# EAGLE board SaintCon2015Badge (EAGLE 7.3.0)
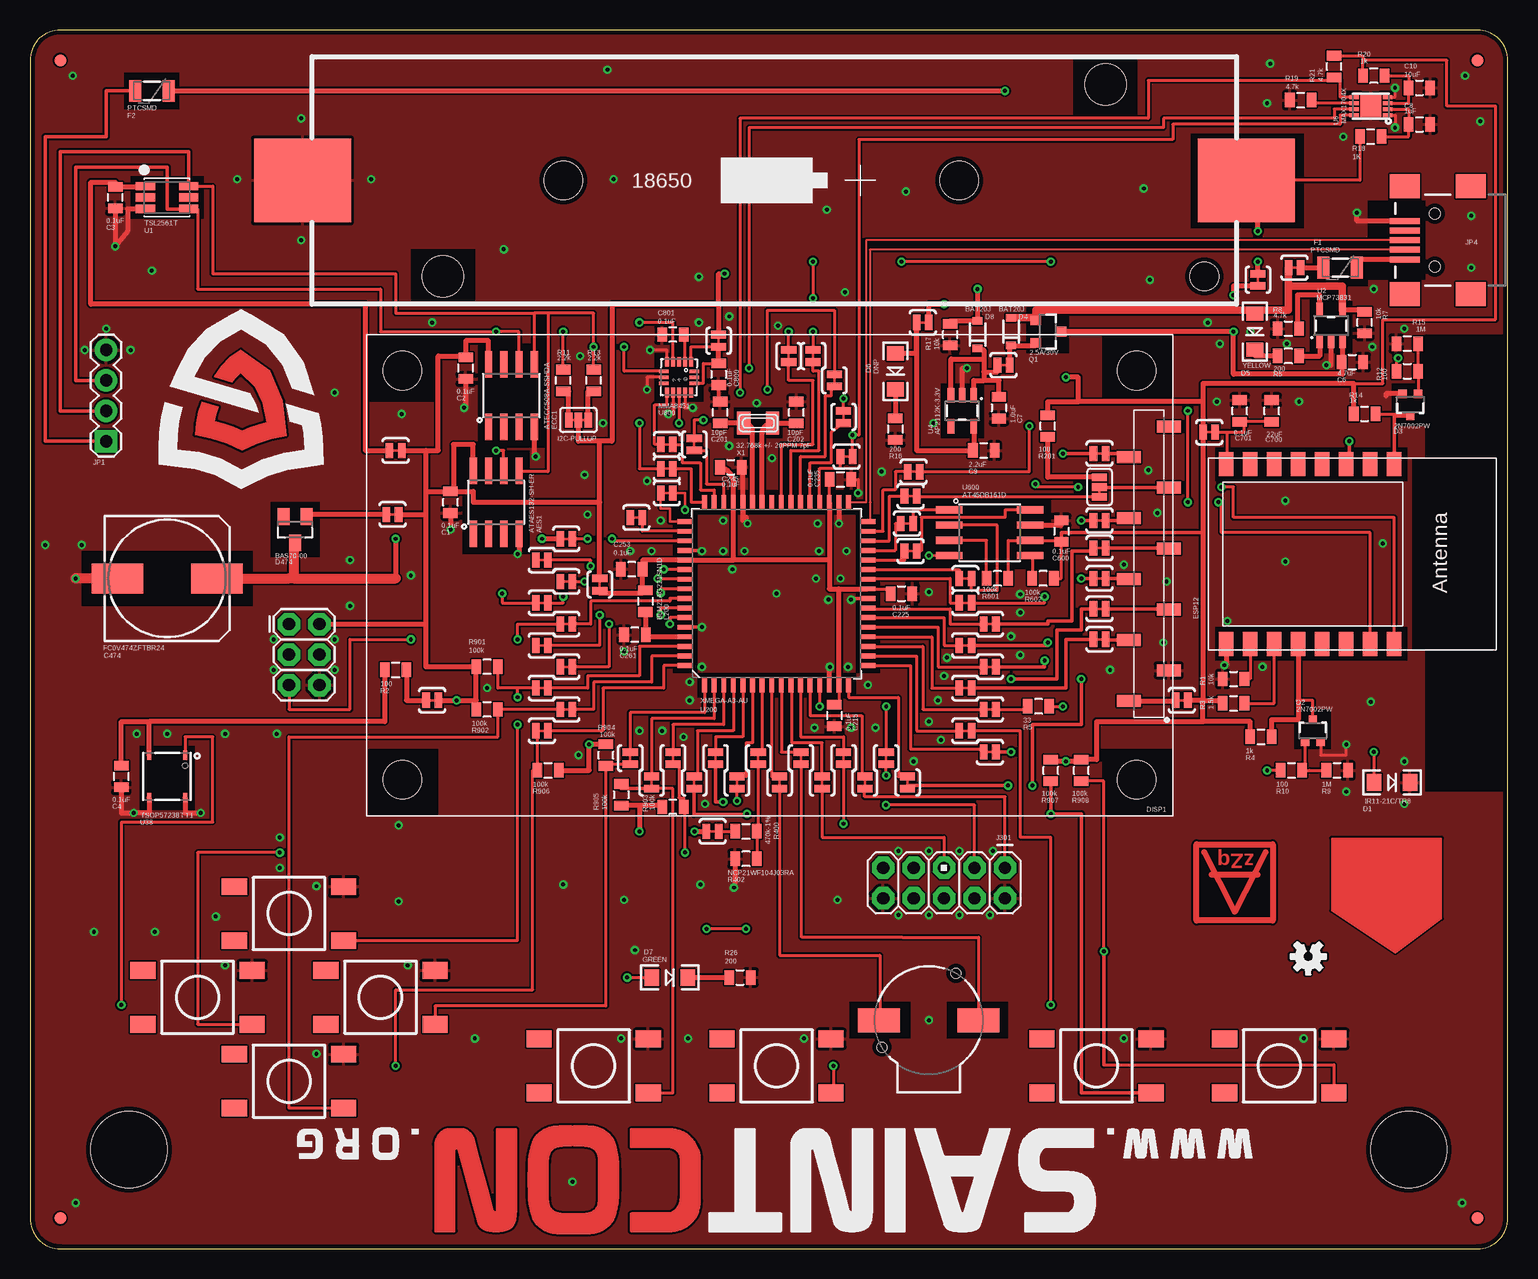
[diagram p3: board, top side]
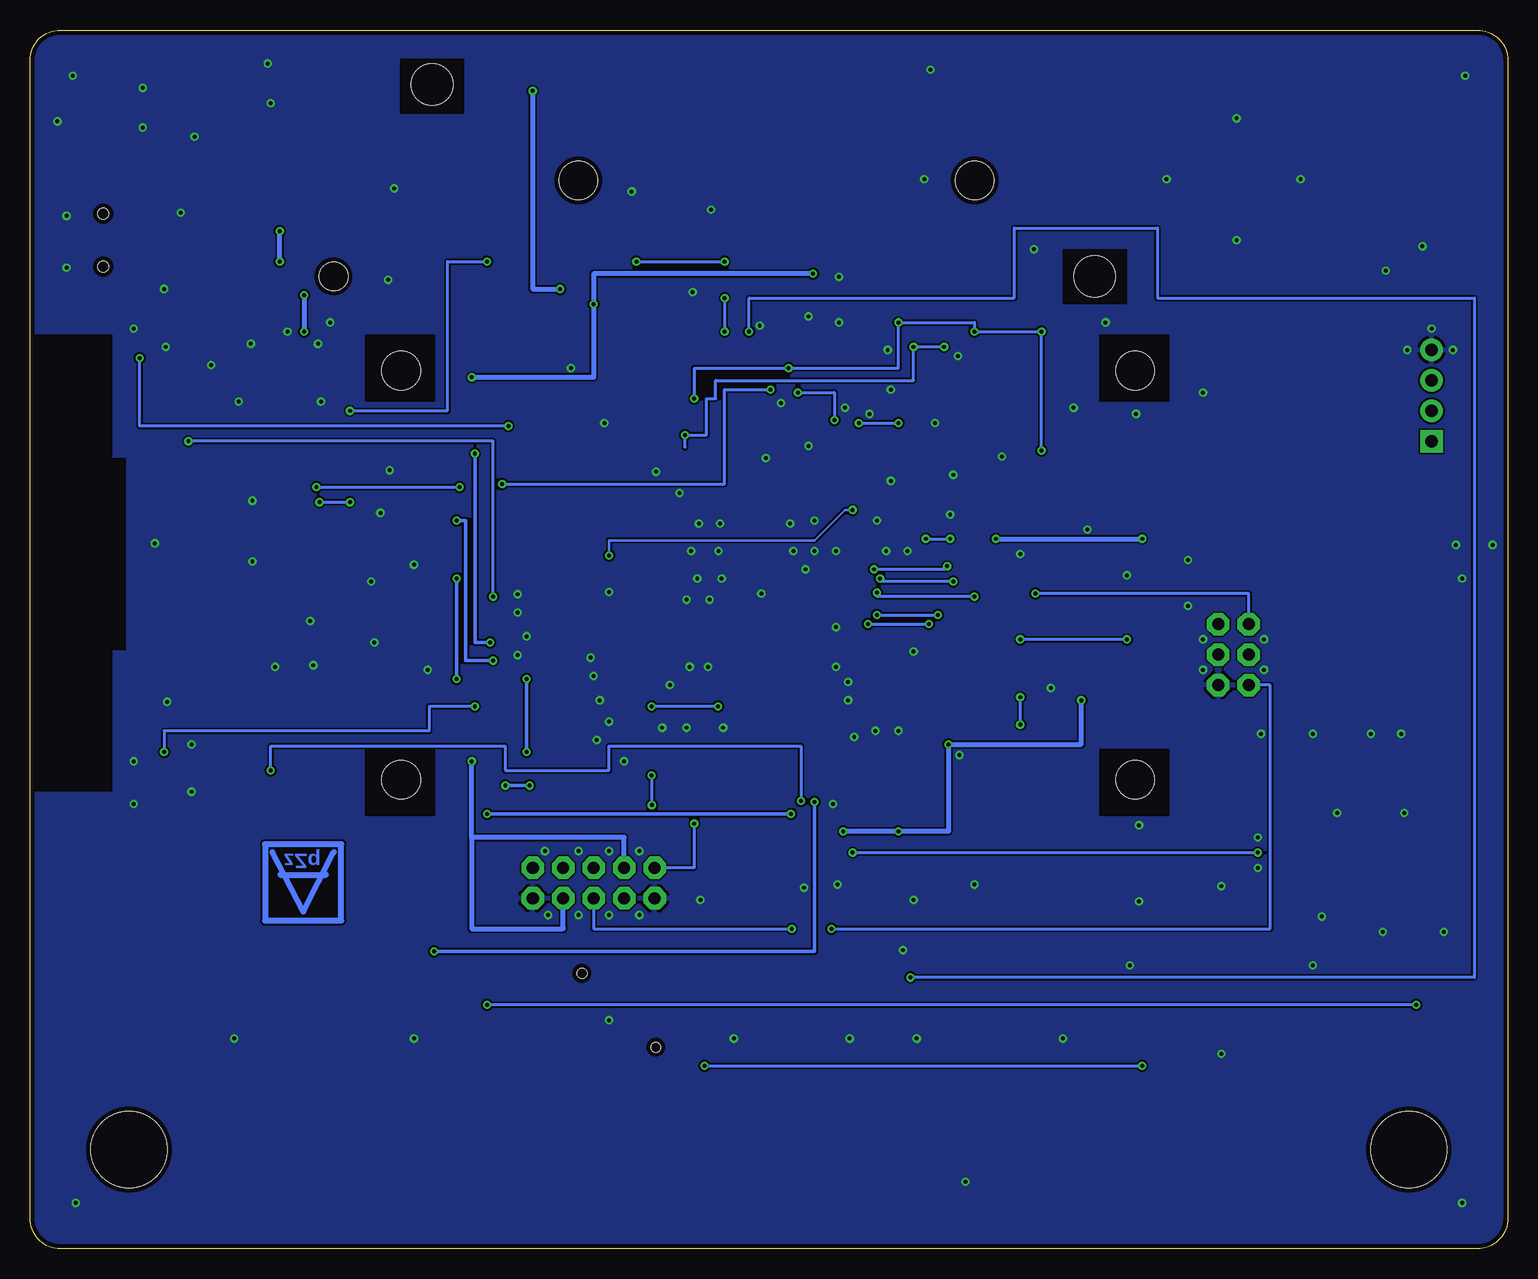
[diagram p4: board, bottom side, seen from below]

Size 123.19 x 101.6 mm. Coordinates in mm from the lower left corner, seen from the top.
Outline: 0,99.06 0,2.54 arc90 2.54,0 120.65,0 arc90 123.19,2.54 123.19,99.06 arc90 120.65,101.6 2.54,101.6 arc90 0,99.06
Copper layers (1*16): Top 0.0356mm / dielectric 1.5011mm / Bottom 0.0356mm
Design rules "LaenPCBOrder": minimum track width 6mil, minimum drill 13mil, track to track 6mil, track to pad 6mil, pad to pad 6mil, via to via 6mil, smd to smd 6mil, copper to edge 15mil, drill to drill 6mil, minimum pad ring 7mil, minimum via ring 7mil, stop-mask expansion 3mil, vias tented up to drill 14mil, thermal gap 10mil
Holes 6.35 mm at 8.26,8.26 114.94,8.26
tRestrict: area 116.3,38.1 to 123.2,76.2; area 106.7,74.7 to 110.2,79; area 75.9,67.6 to 79.5,72.1; area 9.1,36.6 to 13.7,41.9; area 8.4,85.9 to 14.5,89.4; area 53.6,48 to 55.6,61.2; area 68.8,48 to 70.9,61.2; area 55.6,61.2 to 68.8,63.2; area 55.6,46 to 68.8,48; area 98.8,49 to 114.8,51.8; area 98.8,64 to 114.8,66.8; area 52.1,70.6 to 56.1,74.7; 21 more areas
bRestrict: area 116.3,38.1 to 123.2,76.2; area 28.2,36.1 to 34,41.7; area 89.4,70.6 to 95.2,76.2; area 89.4,36.1 to 95.2,41.7; area 28.2,70.6 to 34,76.2

## Footprints (pad centres in the part's own frame; a part is rotated, then mirrored left to right if it is on the bottom)
SOIC8 = smd 0.61 x 2.21: 1 -1.905,-2.616; 2 -0.635,-2.616; 3 0.635,-2.616; 4 1.905,-2.616; 5 1.905,2.616; 6 0.635,2.616; 7 -0.635,2.616; 8 -1.905,2.616
1042P = smd 8.077 x 6.985: BATT_NEG 3.67,10.325; BATT_POS 82.334,10.325 | hole 3.454: 15.38,2.324; 70.625,18.326 | hole 2.388: 78.842,2.324 | hole 3.2: 25.4,10.325; 58.42,10.325
0805 = smd 0.8 x 1.2: 1 -0.9,0; 2 0.9,0
153CLV-1014 = smd 4.3 x 2.5: + 4.15,0; - -4.15,0
LED-1206 = smd 1.2 x 1.4: A -1.5,0; C 1.5,0
SOT323 = smd 0.7 x 0.7: 1 -0.65,-0.925; 2 0.65,-0.925; 3 0,0.925
SOD-323 = smd 0.63 x 0.83: A 1.15,0; C -1.15,0
SOT23 = smd 1 x 1.4: 1 -0.95,-1.1; 2 0.95,-1.1; 3 0,1.1
TFT22 = smd 2 x 1: CS 3.63,25.45; D/C 3.63,20.37; GND 0.33,27.99; LED 0.33,12.75; MISO 3.63,10.21; MOSI 0.33,17.83; NC 0.33,7.67; RESET 0.33,22.91; SCK 3.63,15.29; VCC 3.63,30.53 | hole 3.2: 3,3; 3,37.1; 64.2,37.1; 64.2,3
ESP-12 = smd 2 x 1.2: 1 -7.5,4.5; 2 -7.5,2.5; 3 -7.5,0.5; 4 -7.5,-1.5; 5 -7.5,-3.5; 6 -7.5,-5.5; 7 -7.5,-7.5; 8 -7.5,-9.5; 9 7.5,-9.5; 10 7.5,-7.5; 11 7.5,-5.5; 12 7.5,-3.5; 13 7.5,-1.5; 14 7.5,0.5; 15 7.5,2.5; 16 7.5,4.5
PTC-1206 = smd 1 x 1.8: 1 -1.4,0; 2 1.4,0
FIDUCIAL-1X2 = smd 1 x 1: 1 0,0
PAD-JUMPER-3-3OF3_NC_BY_TRACE_YES_SILK_FULL_BOX = smd 0.635 x 1.27: 1 -0.813,0; 2 0,0; 3 0.813,0
AVR_ICSP = drill 1.016 pad 1.88 octagon: 1 -1.27,5.08; 2 1.27,5.08; 3 -1.27,2.54; 4 1.27,2.54; 5 -1.27,0; 6 1.27,0; 7 -1.27,-2.54; 8 1.27,-2.54; 9 -1.27,-5.08; 10 1.27,-5.08
1X04 = drill 1.016 pad 1.88 square: 1 0,0 | drill 1.016 pad 1.88: 2 2.54,0; 3 5.08,0; 4 7.62,0
USB-MINIB = smd 2.5 x 0.5: D+ 2.5,0; D- 2.5,0.8; GND 2.5,-1.6; ID 2.5,-0.8; VBUS 2.5,1.6 | smd 2.5 x 2: MTN1 -3,4.5; MTN2 2.5,4.5; MTN3 -3,-4.5; MTN4 2.5,-4.5 | hole 0.9: 0,2.2; 0,-2.2
2X3 = drill 1.016 pad 1.88 octagon: 1 0,0; 2 0,2.54; 3 2.54,0; 4 2.54,2.54; 5 5.08,0; 6 5.08,2.54
SOT23-3 = smd 0.8 x 0.9: 1 -0.95,-1; 2 0.95,-1; 3 0,1.1
TACTILE_SWITCH_ZZQ = smd 2.1 x 1.4: A1 -4.55,-2.25; A2 4.55,-2.25; B1 -4.55,2.25; B2 4.55,2.25
BUZZER-CCV-KIT = smd 3.5 x 2: + 4.15,0; - -4.15,0 | hole 0.8: -3.9,-2.25; 2.25,3.9
PAD-JUMPER-2-NC_BY_TRACE_YES_SILK = smd 0.635 x 1.27: 1 -0.508,0; 2 0.508,0
PAD-JUMPER-3-2OF3_NC_BY_TRACE_YES_SILK_FULL_BOX = smd 0.635 x 1.27: 1 -0.813,0; 2 0,0; 3 0.813,0
TMB-6 = smd 1.6 x 0.7: 1 -1.8,0.95; 2 -1.8,0; 3 -1.8,-0.95; 4 1.8,-0.95; 5 1.8,0; 6 1.8,0.95
SOT23-5 = smd 0.55 x 1.2: 1 -0.95,-1.3; 2 0,-1.3; 3 0.95,-1.3; 4 0.95,1.3; 5 -0.95,1.3
TDFN-8 = smd 0.8 x 0.3: 1 -1.4,0.75; 2 -1.4,0.25; 3 -1.4,-0.25; 4 -1.4,-0.75; 5 1.4,-0.75; 6 1.4,-0.25; 7 1.4,0.25; 8 1.4,0.75 | smd 1.73 x 1.88: EP 0,0
TSOP572 = smd 0.35 x 0.8: 1 -1.5,-1.775; 5 1.5,-1.775; 6 1.5,1.775; 8 -1.5,1.775
TQFP64_14X14MM = smd 0.4 x 1.27: 1 -6,-7.6; 2 -5.2,-7.6; 3 -4.4,-7.6; 4 -3.6,-7.6; 5 -2.8,-7.6; 6 -2,-7.6; 7 -1.2,-7.6; 8 -0.4,-7.6; 9 0.4,-7.6; 10 1.2,-7.6; 11 2,-7.6; 12 2.8,-7.6; 13 3.6,-7.6; 14 4.4,-7.6; 15 5.2,-7.6; 16 6,-7.6; 33 6,7.6; 34 5.2,7.6; 35 4.4,7.6; 36 3.6,7.6; 37 2.8,7.6; 38 2,7.6; 39 1.2,7.6; 40 0.4,7.6; 41 -0.4,7.6; 42 -1.2,7.6; 43 -2,7.6; 44 -2.8,7.6; 45 -3.6,7.6; 46 -4.4,7.6; 47 -5.2,7.6; 48 -6,7.6 | smd 1.27 x 0.4: 17 7.6,-6; 18 7.6,-5.2; 19 7.6,-4.4; 20 7.6,-3.6; 21 7.6,-2.8; 22 7.6,-2; 23 7.6,-1.2; 24 7.6,-0.4; 25 7.6,0.4; 26 7.6,1.2; 27 7.6,2; 28 7.6,2.8; 29 7.6,3.6; 30 7.6,4.4; 31 7.6,5.2; 32 7.6,6; 49 -7.6,6; 50 -7.6,5.2; 51 -7.6,4.4; 52 -7.6,3.6; 53 -7.6,2.8; 54 -7.6,2; 55 -7.6,1.2; 56 -7.6,0.4; 57 -7.6,-0.4; 58 -7.6,-1.2; 59 -7.6,-2; 60 -7.6,-2.8; 61 -7.6,-3.6; 62 -7.6,-4.4; 63 -7.6,-5.2; 64 -7.6,-6
SO08-EIAJ = smd 0.61 x 2.21: 1 -1.905,-3.378; 2 -0.635,-3.378; 3 0.635,-3.378; 4 1.905,-3.378; 5 1.905,3.353; 6 0.635,3.353; 7 -0.635,3.353; 8 -1.905,3.353
QFN-16_0.5MM = smd 0.8 x 0.3: 1 -1.275,1; 2 -1.275,0.5; 3 -1.275,0; 4 -1.275,-0.5; 5 -1.275,-1; 9 1.275,-1; 10 1.275,-0.5; 11 1.275,0; 12 1.275,0.5; 13 1.275,1 | smd 0.3 x 0.8: 6 -0.5,-1.275; 7 0,-1.275; 8 0.5,-1.275; 14 0.5,1.275; 15 0,1.275; 16 -0.5,1.275
XTAL3215 = smd 1.1 x 1.9: P$1 1.2,0; P$2 -1.2,0

## Placement (x,y rotation side)
AES1  ATAES132-SH-ER  [SOIC8]  38.86,62.23 0 top
BATT2  1042P  [1042P]  19.05,78.74 0 top
C1  0.1uF  [0805]  35.05,62.23 90 top
C2  0.1uF  [0805]  36.32,73.41 90 top
C3  0.1uF  [0805]  7.11,87.63 90 top
C4  0.1uF  [0805]  7.62,39.37 90 top
C6  4.7uF  [0805]  110.24,73.91 0 top
C7  1.0uF  [0805]  80.77,70.1 270 top
C8  1uF  [0805]  115.82,93.73 0 top
C9  2.2uF  [0805]  79.5,66.55 0 top
C10  10uF  [0805]  115.82,96.77 0 top
C201  10pF  [0805]  57.53,69.72 90 top
C202  10pF  [0805]  63.88,69.72 90 top
C215  0.1uF  [0805]  67.06,44.45 270 top
C225  0.1uF  [0805]  72.64,54.61 0 top
C235  0.1uF  [0805]  67.56,64.14 0 top
C245  0.1uF  [0805]  58.42,65.15 0 top
C253  0.1uF  [0805]  50.16,56.64 180 top
C261  0.1uF  [0805]  50.42,51.18 180 top
C474  FC0V474ZFTBR24  [153CLV-1014]  11.43,55.88 0 top
C600  0.1uF  [0805]  85.98,59.82 270 top
C700  22uF  [0805]  103.5,69.85 90 top
C701  0.1uF  [0805]  100.84,69.85 90 top
C800  0.1uF  [0805]  57.4,72.9 270 top
C801  0.1uF  [0805]  53.59,76.2 180 top
D1  IR11-21C/TR8  [LED-1206]  113.54,38.86 0 top
D2  2N7002PW  [SOT323]  106.93,43.18 0 top
D3  2N7002PW  [SOT323]  115.06,70.36 180 top
D4  BAT20J  [SOD-323]  81.79,76.45 90 top
D5  YELLOW  [LED-1206]  102.11,76.45 270 top
D6  DNP  [LED-1206]  72.14,73.15 270 top
D7  GREEN  [LED-1206]  53.34,22.61 0 top
D8  BAT20J  [SOD-323]  78.99,76.2 90 top
D474  BAS70-00  [SOT23]  22.1,59.94 180 top
DISP1  [TFT22]  95.25,76.2 180 top
ECC1  ATECC508A-SSHDA  [SOIC8]  40.13,71.12 0 top
ESP12  ESP12  [ESP-12]  109.22,57.91 270 top
F1  PTCSMD  [PTC-1206]  109.22,81.79 180 top
F2  PTCSMD  [PTC-1206]  10.16,96.52 180 top
FID1  FIDUCIAL1X2  [FIDUCIAL-1X2]  2.54,2.54 0 top
FID2  FIDUCIAL1X2  [FIDUCIAL-1X2]  120.65,2.54 0 top
FID3  FIDUCIAL1X2  [FIDUCIAL-1X2]  2.54,99.06 0 top
FID4  FIDUCIAL1X2  [FIDUCIAL-1X2]  120.65,99.06 0 top
FRAME1  FRAME-LETTERNO_PACKAGE  [DUMMY]  0,0 0 top
FRAME2  FRAME-LETTERNO_PACKAGE  [DUMMY]  0,0 0 top
FRAME3  FRAME-LETTERNO_PACKAGE  [DUMMY]  0,0 0 top
I2C-PULLUP  [PAD-JUMPER-3-3OF3_NC_BY_TRACE_YES_SILK_FULL_BOX]  45.72,69.09 180 top
J301  [AVR_ICSP]  76.2,30.48 270 top
JP1  [1X04]  6.35,67.31 90 top
JP4  USBSMD  [USB-MINIB]  117.09,84.07 180 top
L200  BLM21AG221SN1D  [0805]  51.31,53.98 270 top
LOGO1  OSHW-LOGOS-COPPER  [OSHW-LOGO-S_COPPER]  106.55,24.36 180 top
LOGO2  OSHW-LOGOS  [OSHW-LOGO-S]  106.55,24.36 180 top
PDI  FEMALE 2x3  [2X3]  21.59,52.07 270 top
Q1  2.5A/30V  [SOT23-3]  84.84,76.45 270 top
R1  10k  [0805]  100.33,47.5 0 top
R2  100  [0805]  30.48,48.26 0 top
R3  1.5k  [0805]  100.33,45.47 0 top
R4  1k  [0805]  102.62,42.67 0 top
R5  33  [0805]  84.07,45.21 180 top
R6  200  [0805]  104.9,74.42 180 top
R7  10k  [0805]  111.25,77.22 90 top
R8  4.7k  [0805]  104.9,76.71 0 top
R9  1M  [0805]  108.97,39.88 0 top
R10  100  [0805]  105.16,39.88 0 top
R11  2.2k  [0805]  44.45,72.39 90 top
R12  100  [0805]  114.81,73.15 0 top
R13  2.2k  [0805]  46.99,72.39 90 top
R14  1k  [0805]  111.25,69.6 0 top
R15  1M  [0805]  114.81,75.44 180 top
R16  200  [0805]  72.14,68.33 270 top
R17  10k  [0805]  76.71,76.2 90 top
R18  1K  [0805]  111.76,92.71 0 top
R19  4.7k  [0805]  105.92,95.76 0 top
R20  1k  [0805]  112.01,97.79 180 top
R21  4.7k  [0805]  108.71,98.55 90 top
R26  200  [0805]  59.18,22.61 0 top
R201  100  [0805]  84.84,68.58 90 top
R400  470k-1%  [0805]  59.69,34.8 0 top
R402  NCP21WF104J03RA  [0805]  59.69,32.51 180 top
R601  100k  [0805]  80.64,55.88 180 top
R602  100k  [0805]  84.45,55.88 180 top
R901  100k  [0805]  38.1,48.51 180 top
R902  100k  [0805]  38.1,44.96 180 top
R903  100k  [0805]  53.59,36.83 180 top
R904  100k  [0805]  48.01,41.15 90 top
R905  100k  [0805]  49.28,37.85 270 top
R906  100k  [0805]  43.18,39.88 0 top
R907  100k  [0805]  85.09,39.88 90 top
R908  100k  [0805]  87.63,39.88 90 top
S1  FSM4JSMA  [TACTILE_SWITCH_ZZQ]  21.59,27.94 0 top
S2  FSM4JSMA  [TACTILE_SWITCH_ZZQ]  21.59,13.97 0 top
S3  FSM4JSMA  [TACTILE_SWITCH_ZZQ]  13.97,20.95 0 top
S4  FSM4JSMA  [TACTILE_SWITCH_ZZQ]  29.21,20.95 0 top
S5  FSM4JSMA  [TACTILE_SWITCH_ZZQ]  46.99,15.24 0 top
S6  FSM4JSMA  [TACTILE_SWITCH_ZZQ]  62.23,15.24 0 top
S7  FSM4JSMA  [TACTILE_SWITCH_ZZQ]  88.9,15.24 0 top
S8  FSM4JSMA  [TACTILE_SWITCH_ZZQ]  104.14,15.24 0 top
SG1  CBT-09427-SMT  [BUZZER-CCV-KIT]  74.93,19.05 0 top
SJ1  JUMPER-PAD-2-NC_BY_TRACE  [PAD-JUMPER-2-NC_BY_TRACE_YES_SILK]  50.04,40.89 270 top
SJ2  JUMPER-PAD-2-NC_BY_TRACE  [PAD-JUMPER-2-NC_BY_TRACE_YES_SILK]  51.82,38.86 270 top
SJ3  JUMPER-PAD-2-NC_BY_TRACE  [PAD-JUMPER-2-NC_BY_TRACE_YES_SILK]  53.59,40.89 270 top
SJ4  JUMPER-PAD-2-NC_BY_TRACE  [PAD-JUMPER-2-NC_BY_TRACE_YES_SILK]  55.37,38.86 270 top
SJ5  JUMPER-PAD-2-NC_BY_TRACE  [PAD-JUMPER-2-NC_BY_TRACE_YES_SILK]  57.15,40.89 270 top
SJ6  JUMPER-PAD-2-NC_BY_TRACE  [PAD-JUMPER-2-NC_BY_TRACE_YES_SILK]  58.93,38.86 270 top
SJ7  JUMPER-PAD-2-NC_BY_TRACE  [PAD-JUMPER-2-NC_BY_TRACE_YES_SILK]  60.71,40.89 270 top
SJ8  JUMPER-PAD-2-NC_BY_TRACE  [PAD-JUMPER-2-NC_BY_TRACE_YES_SILK]  62.48,38.86 270 top
SJ9  JUMPER-PAD-2-NC_BY_TRACE  [PAD-JUMPER-2-NC_BY_TRACE_YES_SILK]  64.26,40.89 270 top
SJ10  JUMPER-PAD-2-NC_BY_TRACE  [PAD-JUMPER-2-NC_BY_TRACE_YES_SILK]  66.04,38.86 270 top
SJ11  JUMPER-PAD-2-NC_BY_TRACE  [PAD-JUMPER-2-NC_BY_TRACE_YES_SILK]  67.82,40.89 270 top
SJ12  JUMPER-PAD-2-NC_BY_TRACE  [PAD-JUMPER-2-NC_BY_TRACE_YES_SILK]  69.6,38.86 270 top
SJ13  JUMPER-PAD-2-NC_BY_TRACE  [PAD-JUMPER-2-NC_BY_TRACE_YES_SILK]  71.37,40.89 270 top
SJ16  JUMPER-PAD-2-NC_BY_TRACE  [PAD-JUMPER-2-NC_BY_TRACE_YES_SILK]  73.15,38.86 270 top
SJ17  JUMPER-PAD-2-NC_BY_TRACE  [PAD-JUMPER-2-NC_BY_TRACE_YES_SILK]  80.01,41.4 0 top
SJ18  JUMPER-PAD-2-NC_BY_TRACE  [PAD-JUMPER-2-NC_BY_TRACE_YES_SILK]  77.98,43.18 0 top
SJ19  JUMPER-PAD-2-NC_BY_TRACE  [PAD-JUMPER-2-NC_BY_TRACE_YES_SILK]  80.01,44.96 0 top
SJ20  JUMPER-PAD-2-NC_BY_TRACE  [PAD-JUMPER-2-NC_BY_TRACE_YES_SILK]  77.98,46.74 0 top
SJ21  JUMPER-PAD-2-NC_BY_TRACE  [PAD-JUMPER-2-NC_BY_TRACE_YES_SILK]  80.01,48.51 0 top
SJ22  JUMPER-PAD-2-NC_BY_TRACE  [PAD-JUMPER-2-NC_BY_TRACE_YES_SILK]  77.98,50.29 0 top
SJ23  JUMPER-PAD-2-NC_BY_TRACE  [PAD-JUMPER-2-NC_BY_TRACE_YES_SILK]  80.01,52.07 0 top
SJ25  JUMPER-PAD-2-NC_BY_TRACE  [PAD-JUMPER-2-NC_BY_TRACE_YES_SILK]  47.5,55.37 90 top
SJ26  JUMPER-PAD-2-NC_BY_TRACE  [PAD-JUMPER-2-NC_BY_TRACE_YES_SILK]  77.98,53.85 0 top
SJ27  JUMPER-PAD-2-NC_BY_TRACE  [PAD-JUMPER-2-NC_BY_TRACE_YES_SILK]  77.98,55.88 0 top
SJ28  JUMPER-PAD-2-NC_BY_TRACE  [PAD-JUMPER-2-NC_BY_TRACE_YES_SILK]  73.41,58.17 0 top
SJ29  JUMPER-PAD-2-NC_BY_TRACE  [PAD-JUMPER-2-NC_BY_TRACE_YES_SILK]  73.1,60.45 0 top
SJ30  JUMPER-PAD-2-NC_BY_TRACE  [PAD-JUMPER-2-NC_BY_TRACE_YES_SILK]  73.41,62.74 0 top
SJ31  JUMPER-PAD-2-NC_BY_TRACE  [PAD-JUMPER-2-NC_BY_TRACE_YES_SILK]  73.66,64.77 0 top
SJ36  JUMPER-PAD-2-NC_BY_TRACE  [PAD-JUMPER-2-NC_BY_TRACE_YES_SILK]  68.07,66.04 0 top
SJ37  JUMPER-PAD-2-NC_BY_TRACE  [PAD-JUMPER-2-NC_BY_TRACE_YES_SILK]  67.82,69.34 90 top
SJ38  JUMPER-PAD-2-NC_BY_TRACE  [PAD-JUMPER-2-NC_BY_TRACE_YES_SILK]  67.06,72.39 90 top
SJ39  JUMPER-PAD-2-NC_BY_TRACE  [PAD-JUMPER-2-NC_BY_TRACE_YES_SILK]  65.28,74.42 90 top
SJ40  JUMPER-PAD-2-NC_BY_TRACE  [PAD-JUMPER-2-NC_BY_TRACE_YES_SILK]  63.25,74.42 90 top
SJ46  JUMPER-PAD-2-NC_BY_TRACE  [PAD-JUMPER-2-NC_BY_TRACE_YES_SILK]  55.37,67.06 90 top
SJ47  JUMPER-PAD-2-NC_BY_TRACE  [PAD-JUMPER-2-NC_BY_TRACE_YES_SILK]  53.09,67.06 180 top
SJ48  JUMPER-PAD-2-NC_BY_TRACE  [PAD-JUMPER-2-NC_BY_TRACE_YES_SILK]  53.09,65.02 180 top
SJ49  JUMPER-PAD-2-NC_BY_TRACE  [PAD-JUMPER-2-NC_BY_TRACE_YES_SILK]  53.09,62.99 0 top
SJ50  JUMPER-PAD-2-NC_BY_TRACE  [PAD-JUMPER-2-NC_BY_TRACE_YES_SILK]  50.55,60.96 180 top
SJ51  JUMPER-PAD-2-NC_BY_TRACE  [PAD-JUMPER-2-NC_BY_TRACE_YES_SILK]  44.7,59.18 180 top
SJ54  JUMPER-PAD-2-NC_BY_TRACE  [PAD-JUMPER-2-NC_BY_TRACE_YES_SILK]  42.67,57.4 180 top
SJ55  JUMPER-PAD-2-NC_BY_TRACE  [PAD-JUMPER-2-NC_BY_TRACE_YES_SILK]  44.7,55.63 180 top
SJ56  JUMPER-PAD-2-NC_BY_TRACE  [PAD-JUMPER-2-NC_BY_TRACE_YES_SILK]  42.67,53.85 0 top
SJ57  JUMPER-PAD-2-NC_BY_TRACE  [PAD-JUMPER-2-NC_BY_TRACE_YES_SILK]  44.7,52.07 0 top
SJ58  JUMPER-PAD-2-NC_BY_TRACE  [PAD-JUMPER-2-NC_BY_TRACE_YES_SILK]  42.67,50.29 180 top
SJ59  JUMPER-PAD-2-NC_BY_TRACE  [PAD-JUMPER-2-NC_BY_TRACE_YES_SILK]  44.7,48.51 180 top
SJ62  JUMPER-PAD-2-NC_BY_TRACE  [PAD-JUMPER-2-NC_BY_TRACE_YES_SILK]  42.67,46.74 180 top
SJ63  JUMPER-PAD-2-NC_BY_TRACE  [PAD-JUMPER-2-NC_BY_TRACE_YES_SILK]  44.7,44.96 180 top
SJ64  JUMPER-PAD-2-NC_BY_TRACE  [PAD-JUMPER-2-NC_BY_TRACE_YES_SILK]  42.67,43.18 180 top
SJ101  JUMPER-PAD-2-NC_BY_TRACE  [PAD-JUMPER-2-NC_BY_TRACE_YES_SILK]  105.41,81.79 180 top
SJ102  JUMPER-PAD-2-NC_BY_TRACE  [PAD-JUMPER-2-NC_BY_TRACE_YES_SILK]  81.15,73.66 180 top
SJ103  JUMPER-PAD-2-NC_BY_TRACE  [PAD-JUMPER-2-NC_BY_TRACE_YES_SILK]  74.42,77.22 0 top
SJ104  JUMPER-PAD-2-NC_BY_TRACE  [PAD-JUMPER-2-NC_BY_TRACE_YES_SILK]  102.36,80.77 270 top
SJ105  JUMPER-PAD-2-NC_BY_TRACE  [PAD-JUMPER-2-NC_BY_TRACE_YES_SILK]  98.3,68.07 180 top
SJ106  JUMPER-PAD-2-NC_BY_TRACE  [PAD-JUMPER-2-NC_BY_TRACE_YES_SILK]  57.4,75.69 90 top
SJ108  JUMPER-PAD-2-NC_BY_TRACE  [PAD-JUMPER-2-NC_BY_TRACE_YES_SILK]  33.53,45.72 0 top
SJ109  JUMPER-PAD-2-NC_BY_TRACE  [PAD-JUMPER-2-NC_BY_TRACE_YES_SILK]  30.48,66.55 0 top
SJ201  JUMPER-PAD-2-NC_BY_TRACE  [PAD-JUMPER-2-NC_BY_TRACE_YES_SILK]  96.01,45.72 0 top
SJ203  JUMPER-PAD-2-NC_BY_TRACE  [PAD-JUMPER-2-NC_BY_TRACE_YES_SILK]  89.15,50.8 180 top
SJ204  JUMPER-PAD-2-NC_BY_TRACE  [PAD-JUMPER-2-NC_BY_TRACE_YES_SILK]  89.15,53.34 180 top
SJ205  JUMPER-PAD-2-NC_BY_TRACE  [PAD-JUMPER-2-NC_BY_TRACE_YES_SILK]  89.15,55.88 180 top
SJ206  JUMPER-PAD-2-NC_BY_TRACE  [PAD-JUMPER-2-NC_BY_TRACE_YES_SILK]  89.15,58.42 180 top
SJ207  JUMPER-PAD-2-NC_BY_TRACE  [PAD-JUMPER-2-NC_BY_TRACE_YES_SILK]  89.15,60.71 180 top
SJ208  JUMPER-PAD-3-2OF3_NC_BY_TRACE_SMALL  [PAD-JUMPER-3-2OF3_NC_BY_TRACE_YES_SILK_FULL_BOX]  89.15,63.5 270 top
SJ209  JUMPER-PAD-2-NC_BY_TRACE  [PAD-JUMPER-2-NC_BY_TRACE_YES_SILK]  89.15,66.29 180 top
SJ400  JUMPER-PAD-2-NC_BY_TRACE  [PAD-JUMPER-2-NC_BY_TRACE_YES_SILK]  56.9,34.8 180 top
SJ474  JUMPER-PAD-2-NC_BY_TRACE  [PAD-JUMPER-2-NC_BY_TRACE_YES_SILK]  30.23,61.21 0 top
U1  TSL2561T  [TMB-6]  11.43,87.63 0 top
U2  MCP73831  [SOT23-5]  108.46,76.96 0 top
U4  AP2112K-3.3V  [SOT23-5]  77.72,69.85 180 top
U6  MAX1704X  [TDFN-8]  111.76,95.25 180 top
U38  TSOP57238TT1  [TSOP572]  11.43,39.37 180 top
U200  XMEGA-A3-AU  [TQFP64_14X14MM]  62.23,54.61 0 top
U600  AT45DB161D  [SO08-EIAJ]  80.01,59.69 270 top
U800  MMA8451  [QFN-16_0.5MM]  54.1,72.64 270 top
U$1  AZZQ  [AZZQ]  100.33,30.48 180 top
U$2  A88  [A88]  119.38,34.29 180 top
U$4  SAINTCON-LOGO  [SAINTCON-LOGO]  17.53,70.87 180 top
U$5  SAINTCON-HEADER  [SAINTCON-HEADER]  62.23,5.84 180 top
X1  32.768k +/- 20PPM 7pF  [XTAL3215]  60.71,68.83 180 top

## Tracks (layer width: path | path; a pad name or v marks a point on that pad's centre or on a via)
3.3V  (via drill 0.33)
  Top 0.254: R602.1 85.98,55.88 C600.2 85.98,59.05 U600.6 81.55,59.05 R601.1 | R20.2 111.11,99.06 | 110.35,72.14 112.78,72.14 112.78,77.47 122.17,77.47 122.17,95.25 118.11,95.25 118.11,99.06 111.11,99.06 | R21.2 111.11,99.45 111.11,99.06
  Top 0.305: R905.2 50.8,36.95 | 85.98,59.05 85.98,59.69 97.79,59.69
  Top 0.406: SJ25.2 47.5,62.23 | 47.5,62.23 47.5,67.31 | 47.5,67.31 45.72,67.31 I2C-PULLUP.2 | R904.2 v46.62,42.05 46.62,39.88 R906.2 | R902.2 37.2,45.72 | 37.2,45.72 R901.2 33.02,48.51 33.02,52.07 | SJ108.2 v35.56,45.72 37.2,45.72 | 47.5,62.23 36.96,62.23 36.96,63.13 35.31,63.13 | SJ109.2 33.02,66.55 | 33.02,52.07 33.02,61.21 | 33.02,61.21 33.02,63.13 | 33.02,63.13 33.02,66.55 | 35.31,63.13 C1.2 33.02,63.13 | 47.5,67.31 48.51,67.31 48.51,78.74 57.4,78.74 | PDI.2 33.02,52.07 | R905.2 52.69,36.95 R903.2 | v55.4,34.8 SJ400.2 | 50.8,36.95 v50.8,34.8 | v86.36,40.64 86.36,40.78 | 85.09,40.91 R907.2 85.09,40.64 v86.36,40.64 | R14.1 110.35,72.14 97.79,72.14 97.79,70.61 | 97.79,70.61 SJ105.2 97.79,59.69 97.79,45.72 | 57.4,78.74 SJ106.2 | 87.38,70.61 87.38,72.64 v86.36,72.64 | 97.79,70.61 87.38,70.61 | 57.4,78.74 57.4,81.28 v57.91,81.28 | SJ474.2 33.02,61.21 | 97.79,45.72 SJ201.2 | 97.79,43.94 101.72,43.94 R4.1 | 97.79,43.94 97.79,45.72 | 97.79,43.94 88.9,43.94 88.9,40.78 R908.2 87.63,40.64 v86.36,40.64 | 97.79,45.72 99.43,45.72 R3.1 | R201.2 84.84,70.61 87.38,70.61 | 33.02,66.55 34.04,66.55 34.04,74.42 35.81,74.42 C2.2 36.32,75.69 38.23,75.69 ECC1.8 | AES1.8 36.96,67.06 35.31,67.06 35.31,63.13 | SJ103.2 74.93,78.74 v76.2,78.74
  Bottom 0.406: v35.56,45.72 35.56,42.05 v46.62,42.05 46.62,34.8 v50.8,34.8 v55.4,34.8 | J301.7 73.66,34.29 86.36,34.29 | 86.36,34.29 86.36,26.67 78.74,26.67 J301.4 | 86.36,34.29 v86.36,40.64 | v86.36,72.64 76.2,72.64 v76.2,78.74 76.2,81.28 v57.91,81.28
56  (via drill 0.33)
  Top 0.254: U200.56 52.58,55.01 v52.58,54.69 | SJ56.2 44.45,53.85 v44.45,54.36
  Bottom 0.254: v44.45,54.36 52.58,54.36 v52.58,54.69
57
  Top 0.254: U200.57 53.34,54.21 53.34,53.98 46.74,53.98 46.74,52.07 SJ57.2
18650-VBAT  (via drill 0.33)
  Top 0.406: 109.41,73.66 C6.1 109.41,73.91 | Q1.3 v100.33,76.45 100.33,72.9 109.41,72.9 109.41,73.91 | SJ104.2 100.33,80.26 v100.33,79.5 | U2.3 109.41,73.91
  Bottom 0.406: v100.33,79.5 v100.33,76.45
/RESET_PDI_CLK  (via drill 0.33)
  Top 0.254: PDI.5 21.59,44.96 26.67,44.96 26.67,50.8 v31.75,50.8 | v40.64,50.8 40.64,52.07 SJ57.1 | v59.69,26.67 v56.39,26.67
  Bottom 0.254: v31.75,50.8 v40.64,50.8 | J301.6 76.2,26.67 v59.69,26.67 | v56.39,26.67 19.81,26.67 19.81,46.99 PDI.5
AT45-/RST
  Top 0.254: R601.2 79.75,59.05 U600.3
AT45-/WP
  Top 0.254: U600.5 83.56,57.78 R602.2
AVCC
  Top 0.254: 51.27,51.01 51.74,51.01 arc-90 C261.1 51.31,51.44
  Top 0.406: U200.61 51.74,51.01 | 51.27,52.82 L200.2 51.31,51.44
BATT_POS'  (via drill 0.33)
  Top 0.254: R18.1 110.86,89.06 102.87,89.06
  Top 0.406: SJ104.1 v102.36,82.3 | 102.36,89.06 BATT2.BATT_POS | v102.36,84.84 102.36,89.06 | 102.36,89.06 102.87,89.06
  Bottom 0.406: v102.36,82.3 v102.36,84.84
BUZZ1
  Top 0.254: 64.31,40.39 64.31,25.96 72.72,25.96 79.08,25.96 SG1.+
  Top 0.305: 64.31,40.39 SJ9.2
BUZZ2
  Top 0.254: SJ8.2 62.48,24.46 70.84,24.46 70.84,19.05
  Top 0.305: 70.84,19.05 SG1.-
CR1220-VBATT  (via drill 0.33)
  Top 0.406: SJ51.2 v42.67,59.18 | v30.48,59.18 30.48,55.88 | D474.3 21.98,58.84
  Top 0.813: C474.+ 21.59,55.88 21.98,55.88 | 21.98,55.88 30.48,55.88 | 21.98,58.84 21.98,55.88
  Bottom 0.406: v42.67,59.18 v30.48,59.18
D4-OUT
  Top 0.406: SJ102.1 81.66,75.05 D4.C 83.84,75.3 Q1.2
D5-R6
  Top 0.406: R6.2 102.11,74.42 D5.C
D6-R16
  Top 0.406: D6.C R16.1
D7-R26
  Top 0.406: D7.C R26.1
DISP1-CS
  Top 0.305: DISP1.CS 89.66,50.75 SJ203.1
DISP1-D/C
  Top 0.305: SJ205.1 91.62,55.88 DISP1.D/C
DISP1-MISO
  Top 0.305: SJ209.1 91.62,66.29 DISP1.MISO
DISP1-MOSI
  Top 0.305: SJ206.1 94.92,58.42 DISP1.MOSI
DISP1-RESET
  Top 0.305: SJ204.1 94.92,53.34 DISP1.RESET
DISP1-SCK
  Top 0.305: SJ207.1 91.62,60.71 DISP1.SCK
DISP1-VCC
  Top 0.406: DISP1.VCC 95.5,45.67 SJ201.1
DISP-CS
  Top 0.305: SJ20.2 86.36,46.74 86.36,50.8 SJ203.2
DISP-DC/RS  (via drill 0.33)
  Top 0.305: SJ16.2 73.15,38.61 v81.53,38.61 | v83.57,38.61 83.57,43.69 87.63,43.69 v87.63,47.5 | v87.63,55.88 SJ205.2
  Bottom 0.305: v81.53,38.61 v83.57,38.61 | v87.63,47.5 v87.63,55.88
DISP-LED
  Top 0.305: DISP1.LED 89.15,63.45 SJ208.2
DISP-LED-100
  Top 0.406: SJ208.1 84.84,64.31 R201.1
DISP-LED-PWM
  Top 0.254: SJ30.2 73.91,62.69 SJ208.3
DISP-MISO  (via drill 0.33)
  Top 0.305: SJ22.2 84.84,50.29 v84.84,50.55 | v86.11,66.29 SJ209.2
  Bottom 0.305: v84.84,50.55 86.11,50.55 v86.11,66.29
DISP-MOSI
  Top 0.305: SJ23.2 84.84,52.07 84.84,52.32 86.87,52.32 86.87,58.17 88.65,58.17 SJ206.2
DISP-RESET  (via drill 0.33)
  Top 0.305: SJ204.2 87.63,53.34 87.63,51.56 85.6,51.56 85.6,47.5 v81.79,47.5 | v81.79,41.4 SJ17.2
  Bottom 0.305: v81.79,47.5 v81.79,41.4
DISP-SCK  (via drill 0.33)
  Top 0.305: SJ21.2 84.58,48.51 v84.58,49.02 | v87.63,60.71 SJ207.2
  Bottom 0.305: v84.58,49.02 86.87,49.02 86.87,60.71 v87.63,60.71
ESP_CH_PD  (via drill 0.33)
  Top 0.254: SJ26.2 84.58,53.85 v84.58,54.36
  Top 0.305: ESP12.3 109.98,65.41 v109.98,67.31
  Bottom 0.254: v84.58,54.36 84.58,67.31 v109.98,67.31
ESP_GP0_FET  (via drill 0.33)
  Top 0.254: R10.1 v103.12,39.88 | v58.93,37.34 SJ6.2
  Bottom 0.254: v103.12,39.88 103.12,41.91 83.57,41.91 83.57,39.88 74.93,39.88 74.93,41.91 58.93,41.91 v58.93,37.34
ESP_GPIO0
  Top 0.254: 105.66,50.41 ESP12.12 | D2.3 106.93,45.72 105.72,45.72
  Top 0.406: R4.2 103.52,44.1 105.72,44.1 105.72,45.72 ESP12.12
ESP_GPIO0_FET_GATE
  Top 0.254: R10.2 106.28,39.88 | R9.1 106.68,39.88 106.28,39.88 | D2.1 106.28,39.88
ESP_GPIO2
  Top 0.254: R3.2 103.72,45.47 ESP12.11
ESP_GPIO15
  Top 0.254: ESP12.10 101.72,47.5 R1.2
ESP_REST
  Top 0.254: R14.2 115.06,69.6 D3.3 115.19,69.43
  Top 0.305: D3.3 113.72,69.43 ESP12.1
ESP_REST_FET  (via drill 0.33)
  Top 0.254: SJ31.2 83.31,64.77 v83.31,68.58 | v114.05,74.26 113.91,74.17 R12.1
  Bottom 0.254: v83.31,68.58 114.05,68.58 v114.05,74.26
ESP_REST_FET_GATE
  Top 0.254: R15.1 R12.2 115.71,72.64 D3.1
ESP_RX  (via drill 0.33)
  Top 0.254: v99.06,62.23 99.31,62.23 99.31,59.69 111.72,59.69 ESP12.15 | v96.52,62.23 v96.52,69.85 | v65.28,76.45 SJ39.2 | v65.28,82.3 v65.28,79.25 | v85.09,82.3 v72.64,82.3
  Bottom 0.254: v99.06,62.23 v96.52,62.23 | v65.28,79.25 v65.28,76.45 | v85.09,82.3 88.39,82.3 88.39,69.85 v96.52,69.85 | v72.64,82.3 v65.28,82.3
ESP_TX  (via drill 0.33)
  Top 0.254: v99.31,63.5 100.33,63.5 100.33,60.96 113.72,60.96 ESP12.16 | v61.47,71.63 61.47,78.23 67.06,78.23 SJ38.2 | v87.38,63.5 83.82,63.5 v83.82,63.75
  Bottom 0.254: v99.31,63.5 v87.38,63.5 | v83.82,63.75 65.28,63.75 65.28,71.63 v61.47,71.63
ESP_VCC
  Top 0.254: SJ105.1 99.82,68.07 | 99.82,68.07 101.19,68.07 101.19,68.95 | C701.1 101.19,68.95 | C700.1 101.19,68.95 | ESP12.8 99.82,65.41 99.82,68.07
F1-SJ
  Top 0.406: SJ101.1 F1.2
F2-D8-R17  (via drill 0.33)
  Top 0.406: R17.2 76.71,77.35 D8.A v78.99,80.01 | F2.1 v81.28,96.52
  Bottom 0.406: v81.28,96.52 81.28,80.01 v78.99,80.01
FG_ALT  (via drill 0.33)
  Top 0.254: U6.5 109.22,96 109.22,97.4 108.71,97.4 | v59.18,71.37 59.18,94.23 93.22,94.23 93.22,97.4 108.71,97.4 | v56.13,69.09 55.37,69.09 SJ46.2 | 108.71,97.4 R21.1
  Bottom 0.254: v59.18,71.37 56.13,71.37 v56.13,69.09
FG_CELL
  Top 0.254: R18.2 114.92,92.71 C8.1 114.92,95 U6.2
FG_QST
  Top 0.254: U6.6 106.82,95.5 R19.2
FG_VDD
  Top 0.254: U6.3 114.92,95.5 C10.1 114.92,97.79 R20.1
FLASH_SS  (via drill 0.33)
  Top 0.203: v74.93,57.78 U600.4 | SJ49.2 54.61,62.99 v54.61,61.59
  Bottom 0.203: v54.61,61.59 55.24,61.59 57.78,59.05 74.93,59.05 v74.93,57.78
GND  (via drill 0.33)
  Top 0.254: U800.7 51.44,72.64 v51.44,71.63 | U800.5 53.1,74.93 v51.69,74.93 | U800.10 53.6,69.6 | U800.12 54.6,70.1 | C235.2 69.04,64.14 v69.04,62.99 | U6.1 113.79,94.5 v113.79,93.47 | U6.4 113.79,96 v113.79,96.77 | D2.2 107.58,41.15 109.73,41.15 v109.73,42.04
  Top 0.305: U200.52 56.01,58.21 v56.01,58.17 | U200.60 v56.01,51.81 v56.01,51.82 | U200.24 68.45,54.21 v68.45,54.1 | 53.6,69.6 v53.21,69.6 | 54.6,70.1 v55.24,70.1 | C800.2 57.4,70.62 C201.2
  Top 0.406: JP4.GND 110.62,85.67 v110.62,86.36 | U2.2 108.46,73.66 107.95,73.66 | U4.2 77.72,73.41 v78.11,73.41 | U38.6 9.93,36.32 v8.64,36.32 7.62,36.32 C4.1 | U38.8 12.93,36.32 v14.22,36.32 | U1.3 8.13,86.68 8.13,84.84 v7.11,83.57 C3.1 | U200.34 v67.44,60.45 | U200.14 66.63,48.22 arc-90 v66.67,48.51 | ESP12.9 99.72,48.64 v99.57,48.64 | ECC1.4 42.04,66.04 v42.16,66.04 | AES1.4 40.77,57.91 v40.64,57.91 | R402.2 58.79,30.61 v58.67,30.1 | C1.1 v35.05,59.94 | C2.1 36.32,70.1 v36.2,70.1 | C202.2 63.88,70.48 | 57.4,70.62 57.4,70.48 | 59.44,60.71 59.44,65.03 C245.2 | U600.7 85.98,60.33 C600.1 | U200.44 59.43,60.96 59.69,60.96 59.69,60.45 v59.82,60.45 | D3.2 113.03,71.28 113.03,71.12
  Top 0.813: C474.- v3.81,55.88
  other vias: 3.56,97.79 49.53,49.78 119.63,97.79 119.38,3.81 3.81,3.81 94.49,50.55 60.58,70.48 62.36,76.96 74.93,54.74 94.74,55.63 102.74,48.51 93.22,64.9 58.29,66.93 105.79,70.61 114.55,40.64 106.17,17.53 91.19,17.53 64.52,17.53 49.28,17.53 31.5,23.62 23.88,30.23 23.88,16.26 16.26,23.62 72.39,33.15 80.26,33.15 74.93,33.15 77.47,33.15 72.39,27.81 65.41,43.43 68.45,43.43 51.82,58.17 50.04,58.17 52.58,60.71 65.79,58.17 68.07,58.17 57.78,60.71 57.78,58.17 59.56,58.17 58.55,56.64 67.56,55.88 66.55,54.1 65.53,55.88 68.2,48.51 62.23,54.61 54.99,45.72 30.99,69.6 25.4,48.26 25.4,50.8 20.32,50.8 20.32,48.26 52.7,43.18 70.48,43.43 56.26,37.08 54.48,42.67 20.83,34.29 20.83,31.75 77.47,27.81 74.93,27.81 80.01,27.81 55.75,81.03 45.85,74.42 39.5,83.31 31.75,56.13 26.67,53.59 17.27,89.15 22.61,94.23 22.61,84.07 28.45,89.15 111.89,75.18 104.78,75.44 109.47,92.71 120.9,93.98 120.14,86.11 120.14,81.79 114.55,76.71 112.01,80.01 101.73,76.45 99.19,75.44 98.17,77.22 114.55,37.08 99.82,52.32 75.69,45.72 76.2,47.75 76.45,49.28 74.93,43.94 75.95,42.42 73.66,40.64 69.85,46.99 82.55,54.56 91.19,57.02 81.79,51.05 109.73,38.1 67.94,79.76 8.38,74.93 6.35,76.71 26.67,57.4 55.75,77.22 50.42,24.89 98.93,70.61 93.98,61.34 108.08,73.66 75.31,68.83 56.01,48.51 54.99,47.24 51.44,64.01 65.66,60.45 70.99,64.77 90.04,48.26 25.4,71.37 10.16,81.53 4.57,74.93 1.27,58.67 4.32,58.67 11.43,42.93 8.89,42.93 16.26,42.93 20.57,42.93 30.73,28.96 30.73,35.31 10.41,26.42 15.49,27.69 5.33,26.42 37.08,17.53 54.86,17.53 74.93,19.05 67.31,29.08 49.53,29.08 55.88,30.35 44.45,30.35 111.76,45.59 104.65,62.36 104.65,57.28 112.78,58.8 93.34,80.77 92.84,88.39 73.03,88.14 66.42,86.61 48.64,89.15 48.13,98.3 58.29,77.72 46.23,64.52 46.48,61.21 33.53,77.22 38.1,46.74 50.8,43.18 45.72,41.15 47.75,68.83 61.85,65.91 103.12,95.5 103.38,98.81 82.55,53.04 82.55,49.48 45.21,5.59
  pour Top: 123.19,99.06 123.19,2.54 arc-90 120.65,0 2.54,0 arc-90 0,2.54 0,99.06 arc-90 2.54,101.6 120.65,101.6 arc-90
  pour Bottom: 123.19,99.06 123.19,2.54 arc-90 120.65,0 2.54,0 arc-90 0,2.54 0,99.06 arc-90 2.54,101.6 120.65,101.6 arc-90
IR-RX  (via drill 0.33)
  Top 0.254: v85.09,20.32 85.09,34.29 82.55,34.29 82.55,43.18 SJ18.2 | v7.62,20.32 7.62,35.56 15.24,35.56 15.24,42.67 12.93,42.67 U38.1
  Bottom 0.254: v7.62,20.32 v85.09,20.32
IR-RX-VS
  Top 0.406: R2.1 29.58,43.94 9.93,43.94 | U38.5 9.93,43.94 | C4.2 7.62,43.94 9.93,43.94
IR-TX
  Top 0.254: SJ19.2 83.17,44.96 R5.2
IR-TX-R  (via drill 0.33)
  Top 0.254: R5.1 v86.11,45.21 | v112.01,41.4 112.04,41.4 D1.A
  Bottom 0.254: v86.11,45.21 89.92,45.21 89.92,43.18 112.01,43.18 v112.01,41.4
J1-F2
  Top 0.305: F2.2 6.35,96.52 6.35,92.71 1.27,92.71 1.27,67.31 JP1.1
LED1  (via drill 0.33)
  Top 0.254: SJ40.2 v63.25,76.45 | v49.78,22.61 D7.A
  Top 0.406: SJ40.2 63.5,74.93
  Bottom 0.254: v63.25,76.45 63.25,79.25 41.15,79.25 41.15,85.09 29.21,85.09 29.21,79.25 2.79,79.25 2.79,22.61 v49.78,22.61
MCP73831-PROG
  Top 0.406: U2.5 107.51,79.5 105.66,79.5 105.66,76.71 R8.2
MCP73831-STAT
  Top 0.406: R6.1 107.51,74.42 U2.1 107.51,75.69
MMA8451-BYP
  Top 0.254: U800.2 54.6,75.69 C801.1
MMA_INT1  (via drill 0.33)
  Top 0.254: U800.11 v54.1,68.83 | v50.8,68.83 50.8,65.02 SJ48.2
  Bottom 0.254: v54.1,68.83 v50.8,68.83
MMA_INT2
  Top 0.254: SJ47.2 52.07,67.06 52.07,70.36 53.1,70.36 U800.9
MMA_VCC
  Top 0.254: U800.1 55.1,73.8 55.1,75.18 SJ106.1 | C800.1 56.13,73.8 56.13,72.14 U800.14
  Top 0.406: C800.1 SJ106.1
NTC1
  Top 0.254: SJ7.2 60.71,34.91 R400.2 R402.1
PA0
  Top 0.254: U200.62 50.8,50.21 50.8,47.75 46.48,47.75 46.48,46.74 SJ62.1
PA1
  Top 0.254: U200.63 51.82,49.41 51.82,47.24 46.99,47.24 46.99,44.96 SJ63.1
PA2
  Top 0.254: SJ64.1 47.75,43.18 47.75,46.74 52.83,46.74 52.83,48.61 U200.64
PA3
  Top 0.254: U200.1 56.23,44.7 50.04,44.7 SJ1.1
PA4
  Top 0.254: U200.2 57.03,44.2 51.82,44.2 SJ2.1
PA5
  Top 0.254: U200.3 57.83,43.69 53.59,43.69 SJ3.1
PA6
  Top 0.254: U200.4 58.63,43.18 55.63,43.18 55.63,39.37 SJ4.1
PA7
  Top 0.254: U200.5 59.43,42.67 57.15,42.67 SJ5.1
PB0
  Top 0.254: U200.6 60.23,42.16 59.69,42.16 59.69,39.37 SJ6.1
PB1
  Top 0.254: U200.7 61.03,41.4 SJ7.1
PB2
  Top 0.254: U200.8 61.83,39.37 SJ8.1
PB3
  Top 0.254: U200.9 62.63,41.4 SJ9.1
PB4
  Top 0.254: SJ10.1 66.04,42.16 63.5,42.16 63.5,47.01 U200.10
PB5
  Top 0.254: U200.11 64.23,42.67 67.82,42.67 SJ11.1
PB6
  Top 0.254: U200.12 65.03,44.45 69.34,44.45 69.34,39.37 SJ12.1
PB7  (via drill 0.33)
  Top 0.254: U200.13 v65.83,45.21 | v71.37,45.21 SJ13.1
  Bottom 0.254: v65.83,45.21 v71.37,45.21
PC0
  Top 0.254: U200.16 68.23,45.97 72.39,45.97 72.39,39.37 SJ16.1
PC1
  Top 0.254: U200.17 73.41,48.61 73.41,41.66 79.5,41.66 SJ17.1
PC2
  Top 0.254: U200.18 73.91,49.41 73.91,43.18 SJ18.1
PC3
  Top 0.254: U200.19 74.42,50.21 74.42,44.96 SJ19.1
PC4
  Top 0.254: U200.20 75.18,51.01 75.18,46.74 SJ20.1
PC5
  Top 0.254: U200.21 75.69,51.81 75.69,48.51 SJ21.1
PC6
  Top 0.254: U200.22 76.2,52.61 76.2,50.29 SJ22.1
PC7
  Top 0.254: U200.23 69.83,53.34 76.71,53.34 76.71,52.07 SJ23.1
PD0
  Top 0.254: U200.26 69.83,55.88 76.71,55.88 76.71,53.85 SJ26.1
PD1
  Top 0.254: U200.27 77.47,56.61 SJ27.1
PD2
  Top 0.254: U200.28 72.9,57.41 SJ28.1
PD3
  Top 0.254: U200.29 72.14,58.21 72.14,60.45 SJ29.1
PD4
  Top 0.254: U200.30 71.63,59.01 71.63,62.74 SJ30.1
PD5
  Top 0.254: U200.31 71.12,59.81 71.12,63.25 72.14,63.25 72.14,64.77 SJ31.1
PDI_DATA  (via drill 0.33)
  Top 0.254: v39.37,54.61 39.37,53.85 SJ56.1
  Bottom 0.254: PDI.1 21.59,54.61 v39.37,54.61
PE0
  Top 0.254: U200.36 65.83,65.08 67.56,65.08 SJ36.1
PE1
  Top 0.254: U200.37 65.03,65.53 66.8,65.53 66.8,68.07 SJ37.1
PE2
  Top 0.254: U200.38 64.23,66.04 66.29,66.04 66.29,71.12 66.8,71.12 66.8,71.88 SJ38.1
PE3
  Top 0.254: U200.39 63.43,66.55 65.79,66.55 65.79,73.15 65.28,73.15 SJ39.1
PE4
  Top 0.254: U200.40 62.63,67.06 65.28,67.06 65.28,72.39 63.25,72.39 SJ40.1
PF0
  Top 0.254: SJ46.1 56.39,66.55 56.39,63.75 57.83,63.75 U200.46
PF1
  Top 0.254: SJ47.1 54.36,67.06 54.36,65.53 55.88,65.53 55.88,63.25 57.03,63.25 U200.47
PF2
  Top 0.254: 56.23,62.39 U200.48 56.23,62.23 55.12,62.23 55.12,65.02 SJ48.1
PF3
  Top 0.203: U200.49 53.34,60.61 53.34,61.72 52.58,61.72 SJ49.1
PF4
  Top 0.254: U200.50 51.05,59.81 SJ50.1
PF5  (via drill 0.33)
  Top 0.254: U200.51 48.51,59.01 v48.51,59.18 | v46.48,59.18 SJ51.1
  Bottom 0.254: v48.51,59.18 v46.48,59.18
PF6  (via drill 0.33)
  Top 0.254: v46.74,56.9 46.74,57.4 SJ54.1 | U200.54 52.83,56.61 v52.83,56.64
  Bottom 0.254: v52.83,56.64 46.74,56.64 v46.74,56.9
PF7  (via drill 0.33)
  Top 0.254: SJ55.1 v46.23,55.63 | U200.55 52.32,55.81 v52.32,55.88
  Bottom 0.254: v46.23,55.63 52.32,55.63 v52.32,55.88
PR0  (via drill 0.33)
  Top 0.254: U200.58 52.58,53.41 v52.58,52.83 | v47.5,52.83 47.5,50.29 SJ58.1
  Bottom 0.254: v52.58,52.83 v47.5,52.83
PR1  (via drill 0.33)
  Top 0.254: U200.59 53.34,52.61 v53.34,52.07 | v48.26,52.07 48.26,48.51 SJ59.1
  Bottom 0.254: v53.34,52.07 v48.26,52.07
R2-IN
  Top 0.406: R2.2 31.38,45.72 SJ108.1
R11-IN
  Top 0.406: I2C-PULLUP.3 44.91,71.49 R11.1
R13-IN
  Top 0.406: I2C-PULLUP.1 46.53,71.49 R13.1
R400-SJ400
  Top 0.254: SJ400.1 R400.1
REG_OUT
  Top 0.406: U4.5 78.67,66.55 C9.1 73.91,66.55 SJ103.1 73.91,74.65 D6.A
SJ474-D474
  Top 0.406: SJ474.1 23.05,61.21 D474.1
SW_A  (via drill 0.33)
  Top 0.254: v89.51,24.79 89.51,38.98 R908.1 | 89.51,15.34 108.69,15.34 S8.A2
  Top 0.305: 89.51,15.34 v89.51,24.79 | SJ5.2 57.15,37.24 v57.78,37.24
  Bottom 0.305: v57.78,37.24 57.78,24.79 v89.51,24.79
SW_B  (via drill 0.33)
  Top 0.305: S7.A2 87.63,12.99 87.63,36.25 v85.09,36.25 R907.1 | SJ4.2 55.37,36.22 v59.77,36.25
  Bottom 0.305: v59.77,36.25 v85.09,36.25
SW_DOWN
  Top 0.254: SJ63.2 R902.1 39,42.67 21.59,42.67 21.59,11.72 S2.A2
SW_LEFT  (via drill 0.33)
  Top 0.254: v20.83,33.02 13.97,33.02 13.97,18.7 S3.A2 | v54.61,33.02 54.61,36.83 R903.1 | R903.1 54.49,36.95 | SJ3.2 54.1,40.39 54.1,37.59 54.49,37.59 R903.1
  Bottom 0.254: v54.61,33.02 v20.83,33.02
SW_RIGHT
  Top 0.254: SJ1.2 48.01,40.39 R904.1 48.01,20.23 33.76,20.23 S4.A2
SW_SELECT
  Top 0.254: S5.A2 53.59,12.99 53.59,38.35 SJ2.2
  Top 0.305: SJ2.2 49.28,38.35 R905.1
SW_START  (via drill 0.33)
  Top 0.254: SJ64.2 42.28,43.18 R906.1 41.91,39.88 41.91,21.59 30.48,21.59 v30.48,15.24 | v66.97,15.24 66.97,12.99 S6.A2
  Bottom 0.254: v66.97,15.24 v30.48,15.24
SW_UP  (via drill 0.33)
  Top 0.254: SJ62.2 40.64,46.74 | 40.64,46.74 39,46.74 R901.1 | S1.A2 40.64,25.69 v40.64,43.69 | v40.64,45.97 40.64,46.74
  Bottom 0.254: v40.64,43.69 v40.64,45.97
TCK
  Top 0.254: J301.1 81.28,37.67 69.57,37.67 69.57,38.35 SJ12.2
TDI  (via drill 0.33)
  Top 0.254: SJ11.2 v67.82,35.43
  Bottom 0.254: v67.82,35.43 67.82,31.75 J301.9
TDO  (via drill 0.33)
  Top 0.254: J301.3 78.74,36.98 v71.35,36.98 | 71.35,40.39 SJ13.2 v71.37,39.45
  Bottom 0.254: v71.35,36.98 71.35,39.45 v71.37,39.45
TMS
  Top 0.254: SJ10.2 66.04,34.29 76.2,34.29 J301.5
TOSC1
  Top 0.406: U200.43 60.23,68.11 arc90 X1.P$1 C201.1
TOSC2
  Top 0.406: 63.62,68.83 arc-90 C202.1 arc90 63.62,68.83 | U200.42 61.03,67.96 arc-90 X1.P$2 63.62,68.83
TSL2561-VDD
  Top 0.254: 9.63,88.53 U1.1
  Top 0.406: 9.63,88.53 C3.2 7.11,88.9 5.08,88.9 5.08,78.74 27.94,78.74 27.94,66.55 SJ109.1
TWIE_SCL  (via drill 0.33)
  Top 0.254: 40.77,73.66 ECC1.6 40.77,76.45 v38.86,76.45 29.21,76.45 29.21,80.01 13.97,80.01 13.97,86.68 U1.4 | R11.2 v44.45,76.45 | SJ37.2 v67.82,70.87 | U6.7 108.71,95 108.71,94.23 94.49,94.23 94.49,93.47 59.94,93.47 v59.94,73.41 | U800.4 53.6,77.22 v50.8,77.22 | AES1.6 39.5,66.55 v38.86,66.55
  Top 0.305: U1.4 11.43,86.68 11.43,90.17 3.81,90.17 3.81,72.39 JP1.3
  Bottom 0.254: v38.86,66.55 v38.86,76.45 v44.45,76.45 44.45,77.22 v50.8,77.22 50.8,73.41 v59.94,73.41 67.82,73.41 v67.82,70.87
TWIE_SDA  (via drill 0.33)
  Top 0.254: 43.18,77.98 43.18,64.77 40.77,64.77 AES1.5 | U1.6 15.24,88.58 15.24,81.28 30.48,81.28 30.48,77.98 42.04,77.98 | 42.04,77.98 ECC1.5 | R13.2 v46.99,75.18 46.99,77.98 43.18,77.98 | 43.18,77.98 42.04,77.98 | U800.6 52.83,73.15 49.53,73.15 v49.53,75.18 | SJ36.2 v68.58,67.82 69.09,67.82 69.09,92.46 95.25,92.46 95.25,93.73 109.22,93.73 109.22,94.5 U6.8 | 6.35,69.64 JP1.2
  Top 0.305: JP1.2 2.54,69.85 2.54,91.44 13.23,91.44 U1.6
  Bottom 0.254: v46.99,75.18 v49.53,75.18 49.53,72.39 66.04,72.39 66.04,70.87 66.8,70.87 66.8,67.82 v68.58,67.82 68.58,66.8
USARTDO_SPI_MISO
  Top 0.254: U600.8 81.28,61.59 81.28,60.96 74.3,60.96 74.3,58.17 SJ28.2
USARTDO_SPI_MOSI
  Top 0.254: U600.1 73.61,61.59 SJ29.2
USARTDO_SPI_SCK
  Top 0.254: U600.2 80.64,60.33 80.64,54.86 78.49,54.86 SJ27.2
USB-F1
  Top 0.406: JP4.VBUS 110.62,82.47 F1.1
USB_N
  Top 0.152: 70.08,60.61 70.08,62.23 70,62.23 70,83.27 JP4.D-
  Top 0.254: 70.08,60.61 U200.32
USB_P
  Top 0.152: 68.23,62.23 69.7,62.23 69.7,84.07 JP4.D+
  Top 0.254: 68.23,62.23 U200.33
VIN
  Top 0.406: 79.5,73.08 79.5,72.39 | 79.5,73.08 80.64,73.08 SJ102.2 | 79.5,74.17 79.5,74.93 78.99,74.93 D8.C | 79.5,74.17 79.5,73.08 | U4.1 78.67,72.39 79.5,72.39 | C7.1 80.77,72.39 79.5,72.39 | U4.3 76.77,74.17 79.5,74.17
VUSB
  Top 0.406: R7.2 111.25,78.26 U2.4
  Top 0.61: D4.A 83.84,77.6 Q1.1 83.84,78.23 102.11,78.23 | 102.11,78.23 D5.A | 102.11,78.23 104.9,78.23 104.9,80.26 | 104.9,80.26 SJ101.2 | U2.4 109.41,80.26 104.9,80.26
XMEGA_VCC
  Top 0.254: U200.35 66.63,64.14 C235.1 | U200.25 71.74,55.01 C225.1 | U200.15 67.43,45.35 C215.1
  Top 0.406: 58.63,57.41 U200.53 51.06,57.41 C253.1 51.05,54.62 | 58.63,57.41 U200.45 58.63,63.53 arc90 C245.1 | 67.43,55.01 66.63,55.01 U200.35 66.63,57.41 58.63,57.41 | 67.43,55.01 U200.25 | U200.15 67.43,55.01 | L200.1 51.05,54.62 | 51.05,54.62 47.5,54.62 SJ25.1